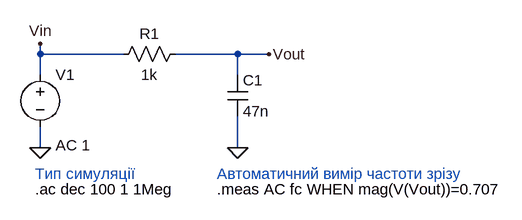
[diagram p0: schematic passive-low-pass-filter.asc]
passive-low-pass-filter.asc, the LTspice schematic file:
Version 4
SHEET 1 944 680
WIRE 48 96 48 80
WIRE 176 96 48 96
WIRE 352 96 256 96
WIRE 400 96 352 96
WIRE 48 128 48 96
WIRE 352 128 352 96
WIRE 48 240 48 208
WIRE 352 240 352 192
FLAG 352 240 0
FLAG 48 240 0
FLAG 400 96 Vout
FLAG 48 80 Vin
SYMBOL voltage 48 112 R0
WINDOW 123 24 124 Left 2
WINDOW 39 0 0 Left 0
SYMATTR Value2 AC 1
SYMATTR InstName V1
SYMATTR Value ""
SYMBOL res 272 80 R90
WINDOW 0 0 56 VBottom 2
WINDOW 3 32 56 VTop 2
SYMATTR InstName R1
SYMATTR Value 1k
SYMBOL cap 336 128 R0
SYMATTR InstName C1
SYMATTR Value 47n
TEXT 40 304 Left 2 !.ac dec 100 1 1Meg
TEXT 320 304 Left 2 !.meas AC fc WHEN mag(V(Vout))=0.707
TEXT 40 280 Left 2 ;Тип симуляції
TEXT 320 280 Left 2 ;Автоматичний вимір частоти зрізу

The netlist it stands for:
* passive-low-pass-filter.asc
V1 Vin 0 AC 1
R1 Vout Vin 1k
C1 Vout 0 47n
.ac dec 100 1 1Meg
.meas AC fc WHEN mag(V(Vout))=0.707
* Тип симуляції
* Автоматичний вимір частоти зрізу
.backanno
.end